# Altium schematic sheet [SCH]_ThermoCouple.SchDoc
size A
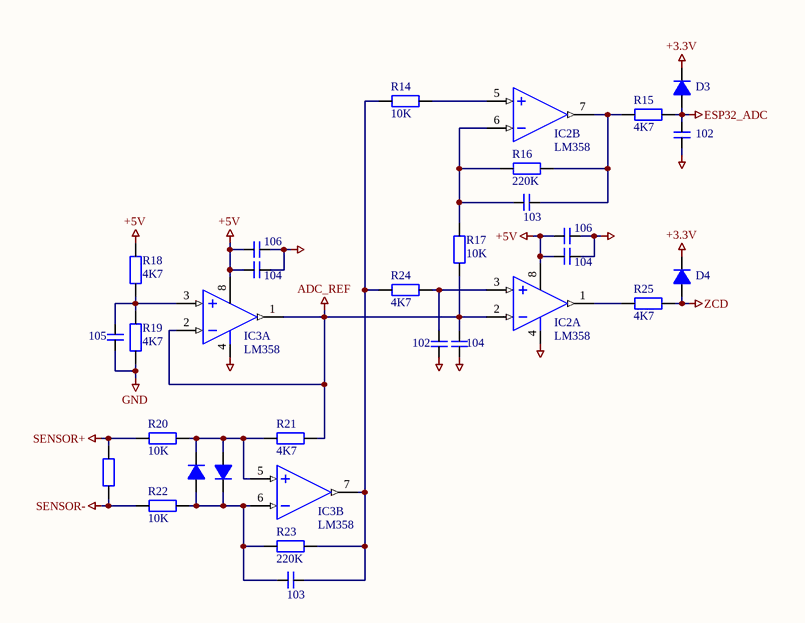
[diagram p0: [SCH]_ThermoCouple.SchDoc]

## Parts
C3  102  [CAP-SMD-01005]
C4  106  [CAP-SMD-01005]
C5  106  [CAP-SMD-01005]
C6  104  [CAP-SMD-01005]
C7  104  [CAP-SMD-01005]
C8  105  [CAP-SMD-01005]
C9  104  [CAP-SMD-01005]
C10  103  [CAP-SMD-01005]
C11  103  [CAP-SMD-01005]
C12  102  [CAP-SMD-01005]
D1  SS14  [SOD 106]  (value not drawn)
D2  SS14  [SOD 106]  (value not drawn)
D3  SS14  [SOD 106]  (value not drawn)
D4  SS14  [SOD 106]  (value not drawn)
IC2  LM358  [DIP8]  (parts A,B of 2)
IC3  LM358  [DIP8]  (parts A,B of 2)
R14  10K  [RES-SMD-0805]
R15  4K7  [RES-SMD-0805]
R16  220K  [RES-SMD-0805]
R17  10K  [RES-SMD-0805]
R18  4K7  [RES-SMD-0805]
R19  4K7  [RES-SMD-0805]
R20  10K  [RES-SMD-0805]
R21  4K7  [RES-SMD-0805]
R22  10K  [RES-SMD-0805]
R23  220K  [RES-SMD-0805]
R24  4K7  [RES-SMD-0805]
R25  4K7  [RES-SMD-0805]
SENSOR3  5R  [Res1/4W]  (value not drawn)

## Nets
+3.3V: D3.2(K) D4.2(K)
+5V: C4.1 C5.1 C6.1 C7.1 IC2.8(+V) IC3.8(+V) R18.2
ADC_REF: C9.2 IC2.2(IN-) IC3.1(OUT) IC3.2(IN-) R17.1 R21.2
ESP32_ADC: C3.2 D3.1(A) R15.1
GND: C3.1 C4.2 C5.2 C6.2 C7.2 C8.1 C9.1 C12.1 IC2.4(-V) IC3.4(-V) R19.1
SENSOR+: R20.2 SENSOR3.2
SENSOR-: R22.2 SENSOR3.1
ZCD: D4.1(A) R25.1
NetC8_2: C8.2 IC3.3(IN+) R18.1 R19.2
NetC10_1: C10.1 IC2.7(OUT) R15.2 R16.1
NetC10_2: C10.2 IC2.6(IN-) R16.2 R17.2
NetC11_1: C11.1 IC3.7(OUT) R14.2 R23.2 R24.2
NetC11_2: C11.2 D1.1(A) D2.2(K) IC3.6(IN-) R22.1 R23.1
NetC12_2: C12.2 IC2.3(IN+) R24.1
NetD1_2: D1.2(K) D2.1(A) IC3.5(IN+) R20.1 R21.1
NetIC2_1: IC2.1(OUT) R25.2
NetIC2_5: IC2.5(IN+) R14.1

## Library data of the parts
C3-C12 = Cap-Non-SMD: Non-polar capacitor
D1-D4 = Diode SMD
IC2 IC3 = LM358: Low-Power Dual Operational Amplifier; Value: LM358
R14-R25 = Res SMD: Resistor SMD
SENSOR3 = Res 1/4W: Resistor 1/4W